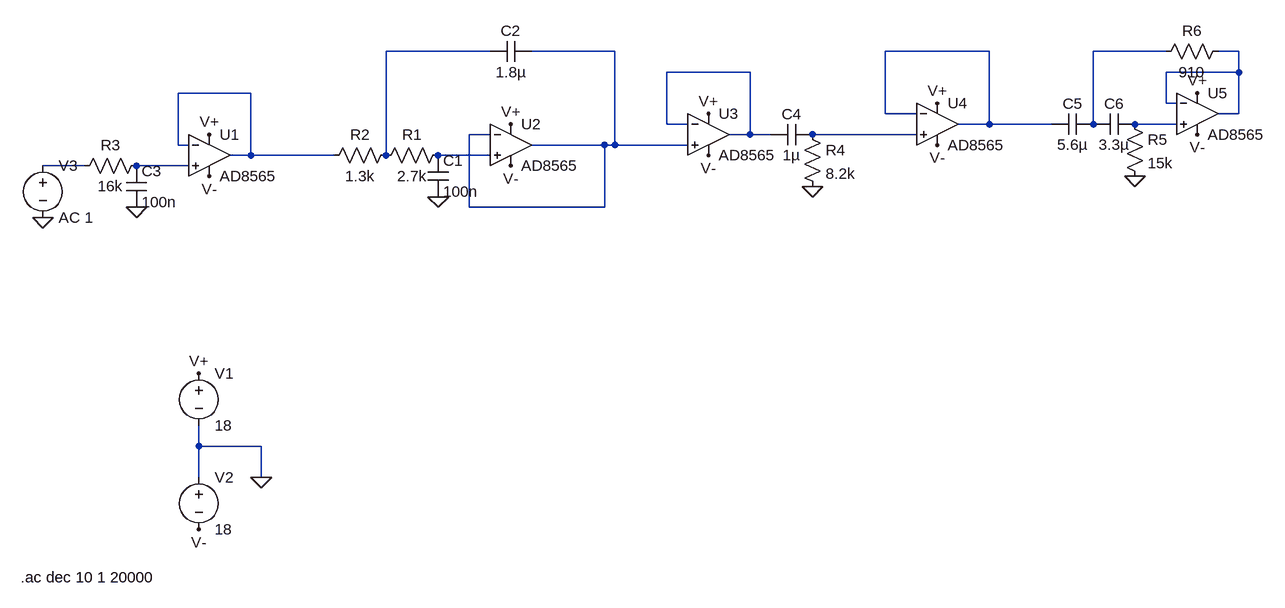
[diagram p0: schematic InputFilter.asc]
InputFilter.asc, the LTspice schematic file:
Version 4
SHEET 1 1856 812
WIRE 656 -16 496 -16
WIRE 848 -16 720 -16
WIRE 1424 -16 1264 -16
WIRE 1696 -16 1584 -16
WIRE 1808 -16 1776 -16
WIRE 1056 16 928 16
WIRE 1808 16 1808 -16
WIRE 1808 16 1696 16
WIRE 288 48 176 48
WIRE 1696 64 1696 16
WIRE 1712 64 1696 64
WIRE 1264 80 1264 -16
WIRE 1312 80 1264 80
WIRE 1808 80 1808 16
WIRE 1808 80 1776 80
WIRE 928 96 928 16
WIRE 960 96 928 96
WIRE 1424 96 1424 -16
WIRE 1424 96 1376 96
WIRE 1520 96 1424 96
WIRE 1584 96 1584 -16
WIRE 1712 96 1648 96
WIRE 656 112 624 112
WIRE 1056 112 1056 16
WIRE 1056 112 1024 112
WIRE 1088 112 1056 112
WIRE 1312 112 1152 112
WIRE 176 128 176 48
WIRE 192 128 176 128
WIRE 832 128 720 128
WIRE 848 128 848 -16
WIRE 848 128 832 128
WIRE 960 128 848 128
WIRE 288 144 288 48
WIRE 288 144 256 144
WIRE 416 144 288 144
WIRE 496 144 496 -16
WIRE 656 144 576 144
WIRE 32 160 -32 160
WIRE 192 160 112 160
WIRE 624 224 624 112
WIRE 832 224 832 128
WIRE 832 224 624 224
WIRE 208 592 208 560
WIRE 304 592 208 592
WIRE 208 640 208 592
WIRE 304 640 304 592
FLAG 576 208 0
FLAG 112 224 0
FLAG 304 640 0
FLAG 208 480 V+
FLAG 224 112 V+
FLAG 688 96 V+
FLAG 208 720 V-
FLAG 224 176 V-
FLAG 688 160 V-
FLAG -32 240 0
FLAG 1648 176 0
FLAG 1152 192 0
FLAG 992 80 V+
FLAG 1344 64 V+
FLAG 1744 48 V+
FLAG 992 144 V-
FLAG 1344 128 V-
FLAG 1744 112 V-
SYMBOL Opamps\\AD8565 224 80 R0
SYMATTR InstName U1
SYMBOL Opamps\\AD8565 688 64 R0
SYMATTR InstName U2
SYMBOL cap 560 144 R0
SYMATTR InstName C1
SYMATTR Value 100n
SYMBOL res 592 128 R90
WINDOW 0 0 56 VBottom 2
WINDOW 3 32 56 VTop 2
SYMATTR InstName R1
SYMATTR Value 2.7k
SYMBOL res 512 128 R90
WINDOW 0 0 56 VBottom 2
WINDOW 3 32 56 VTop 2
SYMATTR InstName R2
SYMATTR Value 1.3k
SYMBOL cap 720 -32 R90
WINDOW 0 0 32 VBottom 2
WINDOW 3 32 32 VTop 2
SYMATTR InstName C2
SYMATTR Value 1.8µ
SYMBOL cap 96 160 R0
SYMATTR InstName C3
SYMATTR Value 100n
SYMBOL res 128 144 R90
WINDOW 0 0 56 VBottom 2
WINDOW 3 32 56 VTop 2
SYMATTR InstName R3
SYMATTR Value 16k
SYMBOL voltage 208 464 R0
WINDOW 123 0 0 Left 0
WINDOW 39 0 0 Left 0
SYMATTR InstName V1
SYMATTR Value 18
SYMBOL voltage 208 624 R0
WINDOW 123 0 0 Left 0
WINDOW 39 0 0 Left 0
SYMATTR InstName V2
SYMATTR Value 18
SYMBOL voltage -32 144 R0
WINDOW 123 0 0 Left 0
WINDOW 39 0 0 Left 0
SYMATTR InstName V3
SYMATTR Value AC 1
SYMBOL Opamps\\AD8565 992 48 R0
SYMATTR InstName U3
SYMBOL Opamps\\AD8565 1344 32 R0
SYMATTR InstName U4
SYMBOL Opamps\\AD8565 1744 16 R0
SYMATTR InstName U5
SYMBOL cap 1152 96 R90
WINDOW 0 0 32 VBottom 2
WINDOW 3 32 32 VTop 2
SYMATTR InstName C4
SYMATTR Value 1µ
SYMBOL res 1136 96 R0
SYMATTR InstName R4
SYMATTR Value 8.2k
SYMBOL cap 1584 80 R90
WINDOW 0 0 32 VBottom 2
WINDOW 3 32 32 VTop 2
SYMATTR InstName C5
SYMATTR Value 5.6µ
SYMBOL cap 1584 112 R270
WINDOW 0 32 32 VTop 2
WINDOW 3 0 32 VBottom 2
SYMATTR InstName C6
SYMATTR Value 3.3µ
SYMBOL res 1632 80 R0
SYMATTR InstName R5
SYMATTR Value 15k
SYMBOL res 1792 -32 R90
WINDOW 0 0 56 VBottom 2
WINDOW 3 32 56 VTop 2
SYMATTR InstName R6
SYMATTR Value 910
TEXT -66 794 Left 2 !.ac dec 10 1 20000

The netlist it stands for:
* InputFilter.asc
XU1 N012 N007 V+ V- N007 AD8565  ; pins In+ In- V+ V- OUT
XU2 N010 N002 V+ V- N002 AD8565  ; pins In+ In- V+ V- OUT
C1 N010 0 100n
R1 N010 N001 2.7k
R2 N001 N007 1.3k
C2 N002 N001 1.8µ
C3 N012 0 100n
R3 N012 N011 16k
V1 V+ 0 18
V2 0 V- 18
V3 N011 0 AC 1
XU3 N002 N006 V+ V- N006 AD8565  ; pins In+ In- V+ V- OUT
XU4 N009 N003 V+ V- N003 AD8565  ; pins In+ In- V+ V- OUT
XU5 N008 N005 V+ V- N005 AD8565  ; pins In+ In- V+ V- OUT
C4 N009 N006 1µ
R4 N009 0 8.2k
C5 N004 N003 5.6µ
C6 N004 N008 3.3µ
R5 N008 0 15k
R6 N005 N004 910
.ac dec 10 1 20000
.backanno
.end